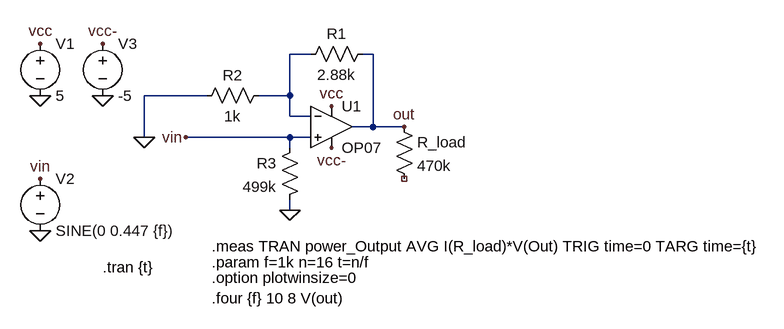
[diagram p0: schematic opamp-preamp.asc]
opamp-preamp.asc, the LTspice schematic file:
Version 4
SHEET 1 880 680
WIRE 96 32 64 32
WIRE 192 32 176 32
WIRE -64 96 -160 96
WIRE 64 96 64 32
WIRE 64 96 16 96
WIRE 64 128 64 96
WIRE 96 128 64 128
WIRE 192 144 192 32
WIRE 192 144 160 144
WIRE 240 144 192 144
WIRE -160 160 -160 96
WIRE 64 160 -96 160
WIRE 96 160 64 160
WIRE 64 176 64 160
WIRE 64 272 64 256
FLAG -320 16 vcc
FLAG -320 96 0
FLAG 128 112 vcc
FLAG -160 160 0
FLAG -320 304 0
FLAG -320 224 vin
FLAG -224 96 0
FLAG -224 16 vcc-
FLAG 128 176 vcc-
FLAG -96 160 vin
FLAG 240 144 out
FLAG 64 272 0
SYMBOL res 192 16 R90
WINDOW 0 0 56 VBottom 2
WINDOW 3 32 56 VTop 2
SYMATTR InstName R1
SYMATTR Value 2.88k
SYMBOL voltage -320 0 R0
WINDOW 123 0 0 Left 0
WINDOW 39 0 0 Left 0
SYMATTR InstName V1
SYMATTR Value 5
SYMBOL voltage -320 208 R0
WINDOW 123 0 0 Left 0
WINDOW 39 24 124 Left 2
SYMATTR InstName V2
SYMATTR Value SINE(0 0.447 {f})
SYMBOL res 32 80 R90
WINDOW 0 0 56 VBottom 2
WINDOW 3 32 56 VTop 2
SYMATTR InstName R2
SYMATTR Value 1k
SYMBOL voltage -224 0 R0
WINDOW 123 0 0 Left 0
WINDOW 39 0 0 Left 0
SYMATTR InstName V3
SYMATTR Value -5
SYMBOL res 224 128 R0
SYMATTR InstName R_load
SYMATTR Value 470k
SYMBOL OpAmps\\OP07 128 80 R0
SYMATTR InstName U1
SYMBOL res 80 160 M0
SYMATTR InstName R3
SYMATTR Value 499k
TEXT -224 360 Left 2 !.tran {t}
TEXT -56 352 Left 2 !.param f=1k n=16 t=n/f
TEXT -56 376 Left 2 !.option plotwinsize=0
TEXT -56 408 Left 2 !.four {f} 10 8 V(out)
TEXT -56 328 Left 2 !.meas TRAN power_Output AVG I(R_load)*V(Out) TRIG time=0 TARG time={t}

The netlist it stands for:
* opamp-preamp.asc
R1 out N001 2.88k
V1 vcc 0 5
V2 vin 0 SINE(0 0.447 {f})
R2 N001 0 1k
V3 vcc- 0 -5
R_load out NC_01 470k
XU1 vin N001 vcc vcc- out LT1001  ; OP07, pins In+ In- V+ V- OUT
R3 vin 0 499k
.tran {t}
.param f=1k n=16 t=n/f
.option plotwinsize=0
.four {f} 10 8 V(out)
.meas TRAN power_Output AVG I(R_load)*V(Out) TRIG time=0 TARG time={t}
.lib LTC.lib
.backanno
.end